# Altium schematic sheet BLOCK DIAGRAM.SchDoc
size A3; DocumentNumber: 2; SheetNumber: 2; SheetTotal: 7; PageSetup: Record=PageOptions|CenterHorizontal=True|CenterVertical=True|PrintScale=0.52|XCorrection=1.00|YCorrection=1.00|PrintKind=1|BorderSize=5000000|LeftOffset=0|BottomOffset=0|Orientation=2|PaperLength=1000|PaperWidth=1000|Scale=100|PaperSource=4|PrintQuality=600|MediaType=1|DitherType=10|PrintScaleMode=1|PaperKind=A4|PaperIndex=9
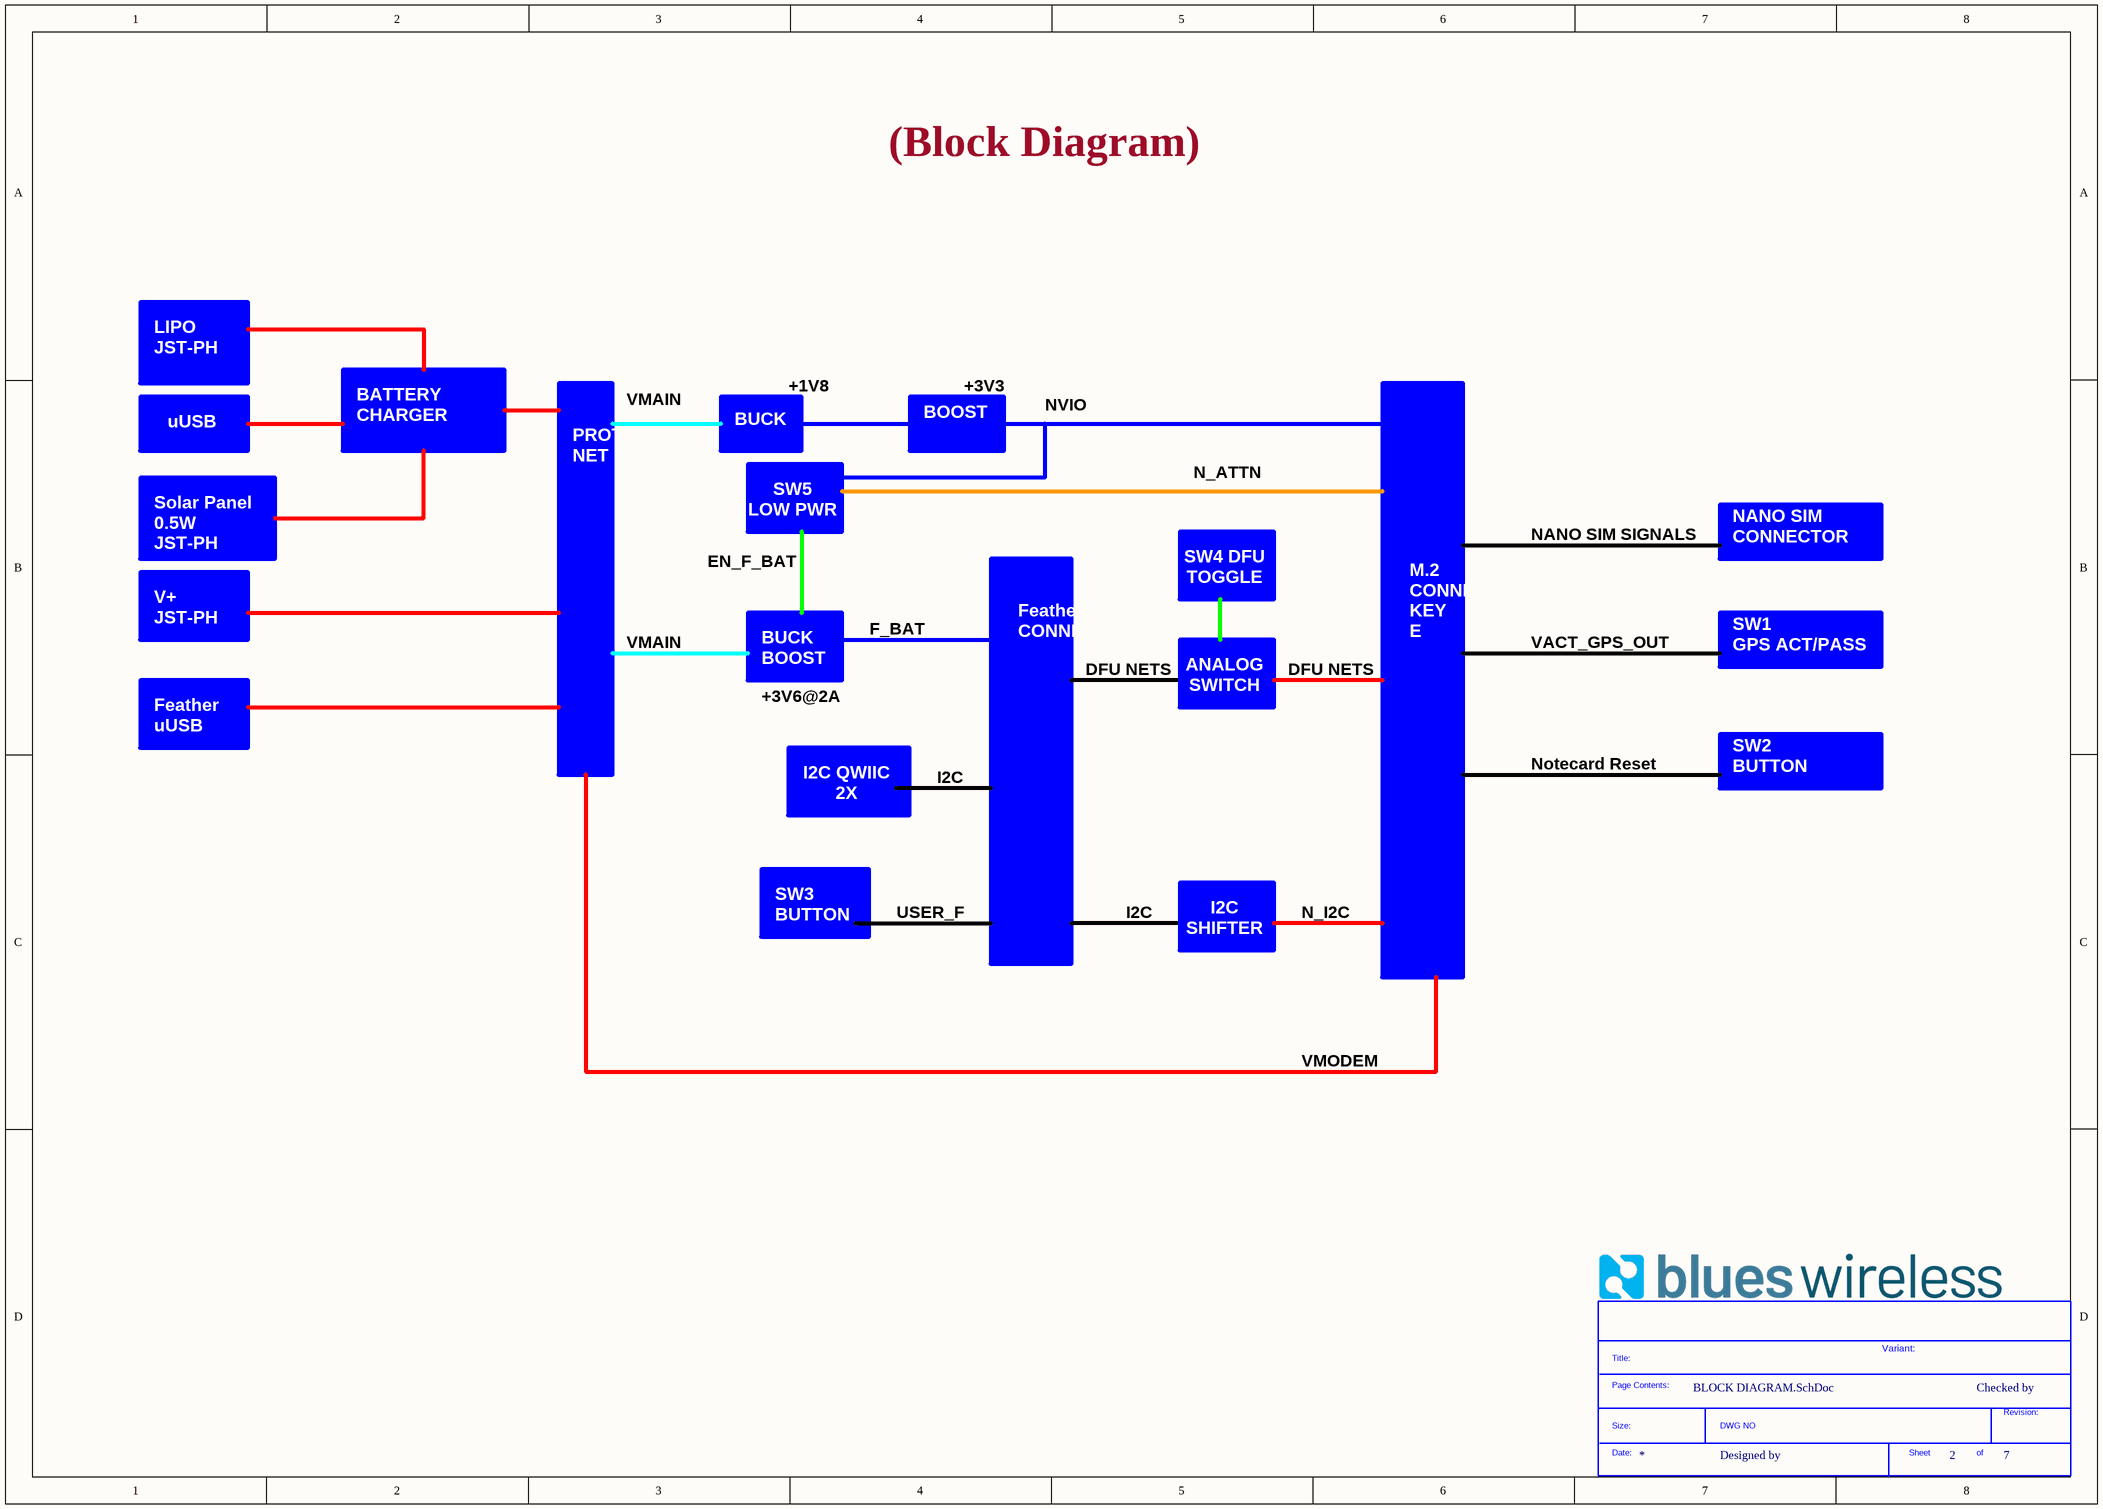
[diagram p0: BLOCK DIAGRAM.SchDoc]

## Parts
*?  SDTitleBlock  (value not drawn)  (graphical)

## Notes on the sheet
- (Block Diagram)
- LIPO
  JST-PH
- uUSB
- BATTERY
  CHARGER
- VMAIN
- BUCK
- +1V8
- BOOST
- +3V3
- NVIO
- N_ATTN
- Solar Panel 0.5W
  JST-PH
- SW5
  LOW PWR
- EN_F_BAT
- NANO SIM SIGNALS
- NANO SIM
  CONNECTOR
- V+
  JST-PH
- F_BAT
- SW4 DFU
  TOGGLE
- VACT_GPS_OUT
- +3V6@2A
- BUCK
  BOOST
- DFU NETS
- ANALOG
  SWITCH
- SW1
  GPS ACT/PASS
- Feather
  uUSB
- PROTECTION   NET
- I2C
- Notecard Reset
- SW2
  BUTTON
- I2C QWIIC
  2X
- SW3
  BUTTON
- USER_F
- Feather CONNECTOR
- N_I2C
- M.2 CONNECTOR KEY E
- I2C
  SHIFTER
- VMODEM
- Variant:
- Checked by
- Designed by
- (in symbol SDTitleBlock) Title:; Page Contents:; Revision:; Size:; DWG NO; Date:; Sheet; of